# Altium schematic sheet TopSheet.SchDoc
size A4
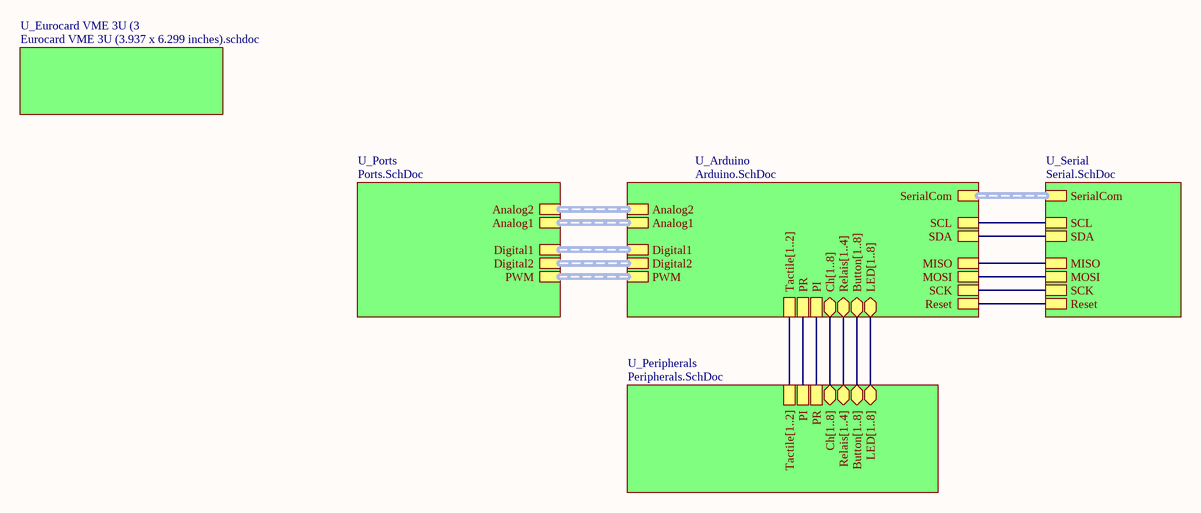
[diagram p0: TopSheet.SchDoc]

## Sub-sheets
U_Arduino = Arduino.SchDoc: SerialCom (harness SerialMC), LED[1..8] (bidir), Button[1..8] (bidir), Relais[1..4] (bidir), PR, PI, Ch[1..8] (bidir), Reset, SCK, MISO, MOSI, Tactile[1..2], Digital1 (harness Digital1), Digital2 (harness Digital2), PWM (harness PWM), Analog2 (harness Analog2), Analog1 (harness Analog1), SCL, SDA
U_Eurocard VME 3U (3 = Eurocard VME 3U (3.937 x 6.299 inches).schdoc: no entries
U_Peripherals = Peripherals.SchDoc: LED[1..8] (bidir), Button[1..8] (bidir), Relais[1..4] (bidir), PI, PR, Ch[1..8] (bidir), Tactile[1..2]
U_Ports = Ports.SchDoc: PWM, Digital1, Digital2, Analog2 (harness Analog2), Analog1 (harness Analog1Port)
U_Serial = Serial.SchDoc: SerialCom (harness Serial3), MISO, Reset, SCK, MOSI, SCL, SDA

## Nets
(unnamed): sheet U_Arduino/PR, sheet U_Peripherals/PI
(unnamed): sheet U_Arduino/PI, sheet U_Peripherals/PR
(unnamed): sheet U_Arduino/Reset, sheet U_Serial/Reset
(unnamed): sheet U_Arduino/SCK, sheet U_Serial/SCK
(unnamed): sheet U_Arduino/MISO, sheet U_Serial/MISO
(unnamed): sheet U_Arduino/MOSI, sheet U_Serial/MOSI
(unnamed): sheet U_Arduino/SCL, sheet U_Serial/SCL
(unnamed): sheet U_Arduino/SDA, sheet U_Serial/SDA

## Buses and harness runs
bus sheet U_Arduino/Button[1..8] = sheet U_Peripherals/Button[1..8]
bus sheet U_Arduino/Ch[1..8] = sheet U_Peripherals/Ch[1..8]
bus sheet U_Arduino/LED[1..8] = sheet U_Peripherals/LED[1..8]
bus sheet U_Arduino/Relais[1..4] = sheet U_Peripherals/Relais[1..4]
bus sheet U_Arduino/Tactile[1..2] = sheet U_Peripherals/Tactile[1..2]
harness sheet U_Arduino/Analog1 = sheet U_Ports/Analog1
harness sheet U_Arduino/Analog2 = sheet U_Ports/Analog2
harness sheet U_Arduino/Digital1 = sheet U_Ports/Digital1
harness sheet U_Arduino/Digital2 = sheet U_Ports/Digital2
harness sheet U_Arduino/PWM = sheet U_Ports/PWM
harness sheet U_Arduino/SerialCom = sheet U_Serial/SerialCom